# Altium schematic sheet MCU.SchDoc: MCU
size A4; Author: Pedro Trenado & Ignacio Cabrera; DrawnBy: Pedro & Ignacio; SheetNumber: 3; proyect: EyeGAIT; Company: ETSI Telecomunicaciones; Address_City: Madrid; Address_Country: Spain; Address_Phone: 910 67 19 00; Address_State_ZIP: 28040; Address_Street: Av. Complutense, 30; TotalSheet: 5; VersionRevision: V 3.0; Address_Website: https://www.etsist.upm.es; #NAME@: pedro.trenado@alumnos.upm.es; License: Student
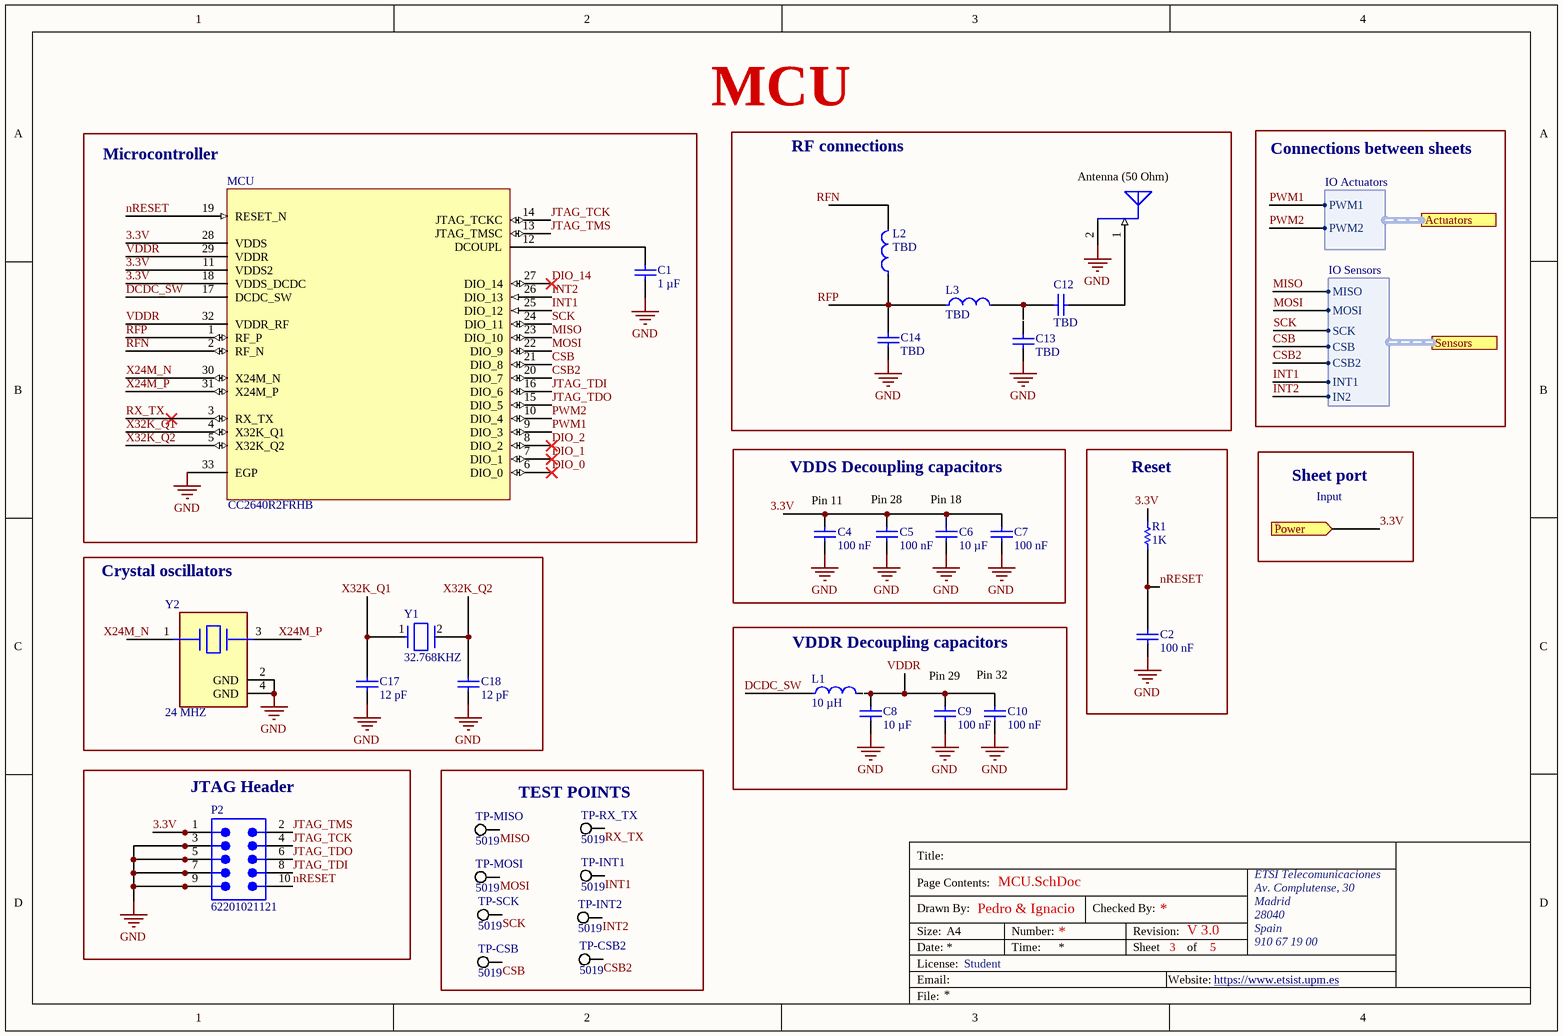
[diagram p0: MCU.SchDoc]

## Parts
Antenna  -  [PCBAntenna]  (value not drawn)  (net tie, no BOM)
C1  1 µF  [CAPC2013X135X45LL10T25]
C2  100 nF  [CAPC1005X55X30LL05T10]
C4  100 nF  [CAPC1005X55X30LL05T10]
C5  100 nF  [CAPC1005X55X30LL05T10]
C6  10 µF  [MURA-0805_H_1.35_M]
C7  100 nF  [CAPC1005X55X30LL05T10]
C8  10 µF  [MURA-0805_H_1.35_M]
C9  100 nF  [CAPC1005X55X30LL05T10]
C10  100 nF  [CAPC1005X55X30LL05T10]
C12  TBD  [CAPC2013X135X45LL10T25]
C13  TBD  [CAPC2013X135X45LL10T25]
C14  TBD  [CAPC2013X135X45LL10T25]
C17  12 pF  [CAPC1608X73X35LL10T15]
C18  12 pF  [CAPC1608X73X35LL10T15]
L1  10 µH  [FP-DFE201210U-MFG]
L2  TBD  [FP-DFE201210U-MFG]
L3  TBD  [FP-DFE201210U-MFG]
MCU  CC2640R2FRHB  [CC2640]  (value not drawn)
P2  62201021121  [62201021121]
R1  1K  [RESC3216X70X50NL05T20]
TP-CSB  5019  [KSTN-5019_V]
TP-CSB2  5019  [KSTN-5019_V]
TP-INT1  5019  [KSTN-5019_V]
TP-INT2  5019  [KSTN-5019_V]
TP-MISO  5019  [KSTN-5019_V]
TP-MOSI  5019  [KSTN-5019_V]
TP-RX_TX  5019  [KSTN-5019_V]
TP-SCK  5019  [KSTN-5019_V]
Y1  32.768KHZ  [FP-ABS07-MFG]
Y2  24 MHZ  [FP-ABM11-MFG]

## Blocks framed on the sheet
Microcontroller: C1 MCU
RF connections: Antenna C12-C14 L2 L3
VDDS Decoupling capacitors: C4-C7
Reset: C2 R1
Crystal oscillators: C17 C18 Y1 Y2
VDDR Decoupling capacitors: C8-C10 L1
JTAG Header: P2
TEST POINTS: TP-CSB TP-CSB2 TP-INT1 TP-INT2 TP-MISO TP-MOSI TP-RX_TX TP-SCK

## Ports
Actuators (harness IO Actuators), Power (in), Sensors (harness IO Sensors)

## Harnesses
IO Actuators: PWM1, PWM2
IO Sensors: MISO, MOSI, SCK, CSB, CSB2, INT1, IN2

## Nets
GND: Antenna.2(GND) C1.1 C2.1 C4.1 C5.1 C6.1 C7.1 C8.1 C9.1 C10.1 C14.1 C17.1 C18.1 MCU.33(EGP) P2.3 P2.5 P2.7 P2.9 Y2.2(GND) Y2.4(GND)
3.3V: C4.2 C5.2 C6.2 C7.2 MCU.11(VDDS2) MCU.18(VDDS_DCDC) MCU.28(VDDS) P2.1 R1.2 ; port Power
CSB: MCU.21(DIO_8) TP-CSB.1 ; port Sensors.CSB
CSB2: MCU.20(DIO_7) TP-CSB2.1 ; port Sensors.CSB2
DCDC_SW: L1.1 MCU.17(DCDC_SW)
DIO_0: MCU.6(DIO_0)
DIO_1: MCU.7(DIO_1)
DIO_2: MCU.8(DIO_2)
DIO_14: MCU.27(DIO_14)
INT1: MCU.25(DIO_12) TP-INT1.1 ; port Sensors.INT1
INT2: MCU.26(DIO_13) TP-INT2.1 ; port Sensors.IN2
JTAG_TCK: MCU.14(JTAG_TCKC) P2.4
JTAG_TDI: MCU.16(DIO_6) P2.8
JTAG_TDO: MCU.15(DIO_5) P2.6
JTAG_TMS: MCU.13(JTAG_TMSC) P2.2
MISO: MCU.23(DIO_10) TP-MISO.1 ; port Sensors.MISO
MOSI: MCU.22(DIO_9) TP-MOSI.1 ; port Sensors.MOSI
nRESET: C2.2 MCU.19(RESET_N) P2.10 R1.1
PWM1: MCU.9(DIO_3) ; port Actuators.PWM1
PWM2: MCU.10(DIO_4) ; port Actuators.PWM2
RFN: L2.2 MCU.2(RF_N)
RFP: C14.2 L2.1 L3.1 MCU.1(RF_P)
RX_TX: MCU.3(RX_TX) TP-RX_TX.1
SCK: MCU.24(DIO_11) TP-SCK.1 ; port Sensors.SCK
VDDR: C8.2 C9.2 C10.2 MCU.29(VDDR) MCU.32(VDDR_RF)
X24M_N: MCU.30(X24M_N) Y2.1
X24M_P: MCU.31(X24M_P) Y2.3
X32K_Q1: C17.2 MCU.4(X32K_Q1) Y1.1
X32K_Q2: C18.2 MCU.5(X32K_Q2) Y1.2
NetAntenna_1: Antenna.1(FeedPoint) C12.1
NetC1_2: C1.2 MCU.12(DCOUPL)
NetC12_2: C12.2 L3.2

Not connected (* = marked no-connect by the designer): C13 1 2; L1 2

## Notes on the sheet
- (near Antenna) Antenna (50 Ohm)
- Connections between sheets
- (near L2) RX_TX pin not used because it is not necessary if internal bias is used, we used the differential antenna that gives us the best performance.
- (near C4) Pin 11
- (near C5) Pin 28
- (near C6) Pin 18
- Sheet port
- Input
- Pin 29
- Pin 32
- Place L1 and C8 close to pin 17 (DCDC_SW).
- (near P2) Header for programming the microcontroller with JTAG.
  Obtained from Headers Library.
- Labels drawn without touching a wire or pin: GND
- Title:
- Drawn By:
- Page Contents:
- Checked By:
- Size:
- Date:
- File:
- License:
- Email:
- A4
- Number:
- Time:
- Revision:
- Sheet
- Website:
- of

## Library data of the parts
Antenna = PCBAntenna: GND pin has a via to a GND plane that is not included in the footprint, but has to be included in the final PCB layout design.
C1 C12-C14 = CMP-1036-04761-2: Manufacturer: Murata; Part Number: GRM21BR71H105KA12L
C2 C4 C5 C7 C9 C10 = CMP-0001-00074-2: Manufacturer: Kemet; Part Number: C0402C104K4RACTU
C6 C8 = CMP-2000-05254-1: CAP, Ceramic, 10 uF, 10%, 10 V, 0805, RoHS, Tape and Reel; Manufacturer: Murata; Voltage - Rated: 10V; Product Training Modules: High-CapMultilayerCeramicCapacitors; Catalog Drawings: GRMSeries_0805_1.25; Temperature Coefficient: X5R; Online Catalog: GRMSeries; Featured Product: GA3SafetyRecognizedCapsandHi-CapMLCC; Capacitance: 10µF; Other Names: 490-1709-6; Applications: GeneralPurpose; Category: Capacitors; Datasheet Version: Aug-14; Datasheet URL: https://datasheet.ciiva.com/3777/210grm21br61a106ke1923-3777175.pdf; Ratings: -; Height - Seated (Max): -; Lead Spacing: -; Operating Temperature: -55degC~85degC; Features: -; Package Description: 2-Pin Surface Mount Device (0805), Body 2.1 x 1.35 mm; Standard Package: 1; Mounting Type: SurfaceMount,MLCC; Package Reference: 805; Tolerance: ±10%; Manufacturer URL: http://www.murata.com/; Size / Dimension: 0.079"Lx0.049"W(2.00mmx1.25mm); Packaging: Digi-Reel; Thickness (Max): 0.053"(1.35mm); Package / Case: 0805(2012Metric); Family: CeramicCapacitors; Series: GRM; Lead Style: -
C17 C18 = CMP-2006-04614-1: Part Number: 06035J120GBSTR; Manufacturer: AVX Interconnect / Elco
L1-L3 = CMP-06042-016271-1: FIXED IND 2.2UH 1.2A 228 MOHM; RoHS Compliant: Yes
P2 = CMP-1502-00948-2: NexarPartId: 32855586; Number of Positions: 10; Contact Resistance: 20mΩ; Current Rating: 1A; Operating Supply Voltage: 100V; Connector Type: Male Pin; Pitch: 1.27mm; Gender: Male; Number of Contacts: 10; Orientation: Vertical; REACH SVHC: Unknown; Contact Plating: Gold; Height: 5.65mm; Voltage Rating: 100V; Packaging: Box; Mount: Through Hole; Number of Pins: 10; Max Operating Temperature: 105°C; Color: Black; Termination: Solder; Number of Rows: 2; Row Spacing: 1.27mm; RoHS: Compliant; Lead Pitch: 1.27mm; Contact Mating Length: 3.81mm; Contact Material: Copper; Min Operating Temperature: -40°C
R1 = CMP-2003-00541-1: Manufacturer: Panasonic; Part Number: ERJ-8GEY0R00V
TP-CSB TP-CSB2 TP-INT1 TP-INT2 TP-MISO TP-MOSI TP-RX_TX TP-SCK = CMP-1672-00008-1: Test Point, 1 Position SMD, RoHS, Tape and Reel; ComponentLink1Description: Manufacturer URL; Package Quantity: 1000; DatasheetVersion: 03/2014; Packaging: Tape and Reel; ComponentLink2URL: http://www.keyelco.com/product-pdf.cfm?p=1357; ComponentLink1URL: http://www.keyelco.com/; Mount: Surface Mount; Contact Plating: Silver; PackageDescription: 1-Pin Surface Mount Device, Body 3.81 x 2.03 mm; Pins: 1; RoHSCompliant: True; Mounting Technology: Surface Mount; ComponentLink2Description: Datasheet; PackageReference: 5019
Y1 = CMP-0447-00001-4: Crystal 32.768kHz ±20ppm (Tol) 12.5pF FUND 70kΩ 2-Pin CSMD T/R; ESR (Equivalent Series Resistance): 70kR; Radiation Hardening: No; Frequency: 32.768kHz; Length: 3.2mm; Max Operating Temperature: 85°C; Number of Pins: 2; Series: ABS07; Min Operating Temperature: -40°C; Frequency Tolerance: 20ppm; Packaging: Tape and Reel; Height: 0.9mm; Width: 1.5mm; Depth: 1.5mm; Load Capacitance: 12.5pF; RoHS Compliant: Yes; Tolerance: 20ppm; Termination: SMD/SMT; Lead Free: Lead Free; Series Resistance: 70kR; REACH SVHC: No SVHC; Case/Package: CSMD; Operating Frequency: 32.768 kHz; Package Quantity: 3000
Y2 = CMP-27762-002563-1: Crystal 24MHz ±20ppm 10pF SMD-4 2mm x 1.6mm; ESR (Equivalent Series Resistance): 100R; Frequency Tolerance: 20ppm; Case/Package: CSMD; Tolerance: 20ppm; Termination: SMD/SMT; Mount: Surface Mount; REACH SVHC: No SVHC; Package Quantity: 3000; Height: 0.023inch; Frequency: 24MHz; Frequency Stability: 20ppm; Packaging: Tape and Reel; Min Operating Temperature: -40°C; Max Operating Temperature: 85°C; Length: 2mm; Width: 1.6mm; Depth: 1.6mm; RoHS Compliant: Yes; Series Resistance: 100R; Series: ABM11; Number of Pins: 4; Load Capacitance: 10pF